# Altium schematic sheet Mixer to LP-HP Filter.SchDoc: Audio_Moduloop - Mixer/Filters
size A; Date: 2/27/2024; DrawnBy: Team 28: Ryan Gordon, Conor Curtin, Evan Roveili, Shawn Colby; DocumentNumber: 4; Revision: V1; SheetNumber: 4; SheetTotal: 7
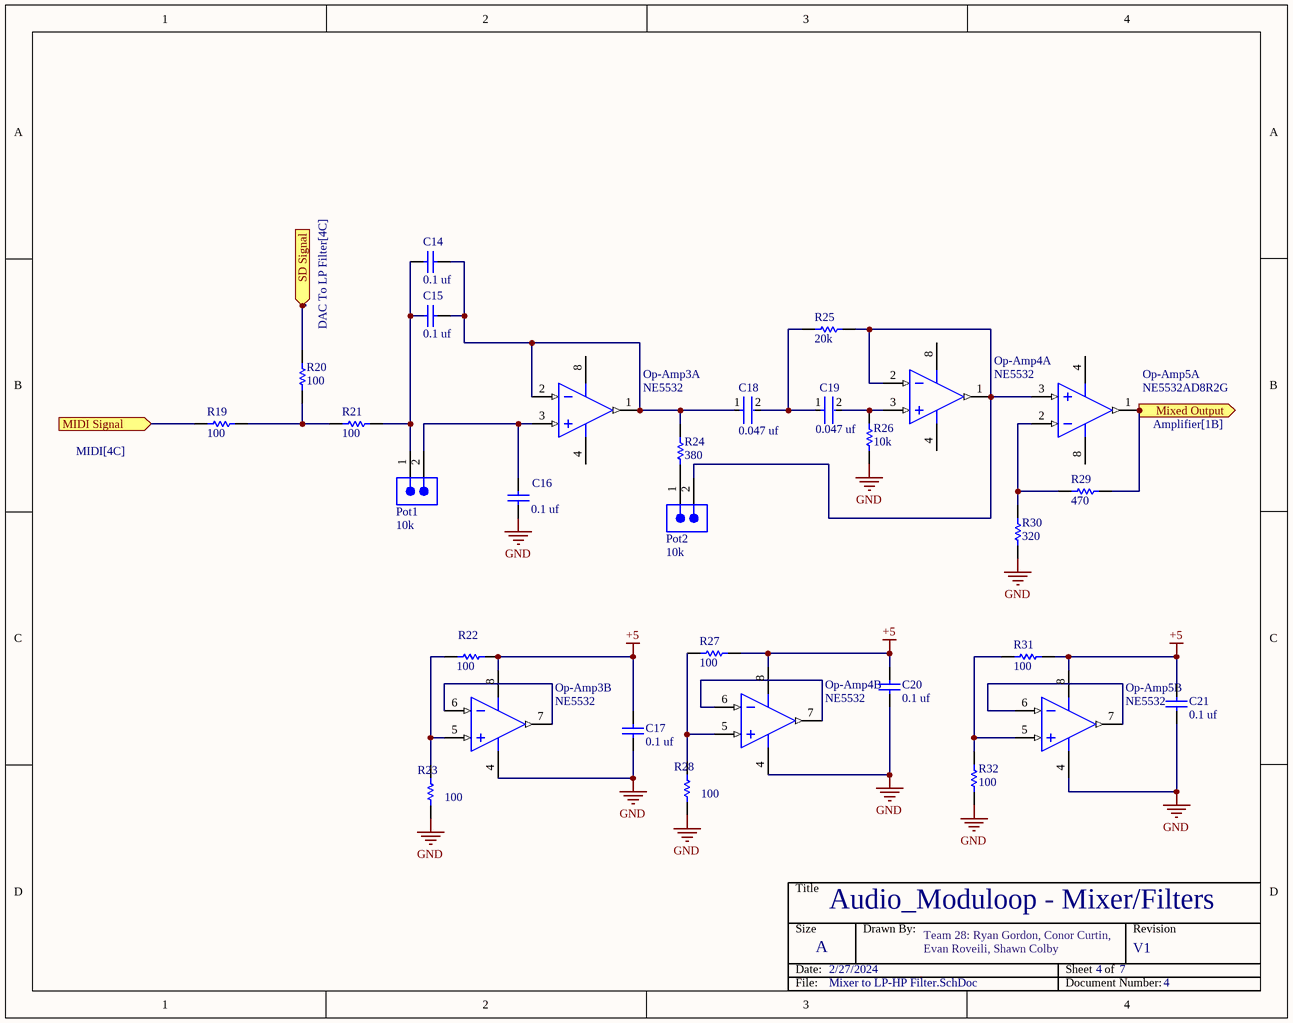
[diagram p0: Mixer to LP-HP Filter.SchDoc]

## Parts
C14  0.1 uf  [AVX-SA115C104KAR]
C15  0.1 uf  [AVX-SA115C104KAR]
C16  0.1 uf  [AVX-SA115C104KAR]
C17  0.1 uf  [AVX-SA115C104KAR]
C18  0.047 uf  [FP-RCE1K1-2_5-MFG]
C19  0.047 uf  [FP-RCE1K1-2_5-MFG]
C20  0.1 uf  [AVX-SA115C104KAR]
C21  0.1 uf  [AVX-SA115C104KAR]
Op-Amp3  NE5532  [ONSC-SOIC-8-751-07_V]  (parts A,B of 2)
Op-Amp4  NE5532  [ONSC-SOIC-8-751-07_V]  (parts A,B of 2)
Op-Amp5  NE5532AD8R2G  [ONSC-SOIC-8-751-07_V]  (parts A,B of 2)
Pot1  10k  [61300211121]
Pot2  10k  [61300211121]
R19  100  [RESC2013X60X40ML20T25]
R20  100  [RESC2013X60X40ML20T25]
R21  100  [RESC2013X60X40ML20T25]
R22  100  [RESC2013X60X40ML20T25]
R23  100  [RESC2013X60X40ML20T25]
R24  380  [RESC2013X60X40LL20T25]
R25  20k  [RESC2013X60X35NL10T20]
R26  10k  [RESC2013X60X35NL10T20]
R27  100  [RESC2013X60X40ML20T25]
R28  100  [RESC2013X60X40ML20T25]
R29  470  [RESC2013X60X40NL20T25]
R30  320  [RESC2013X60X40LL20T25]
R31  100  [RESC2013X60X40ML20T25]
R32  100  [RESC2013X60X40ML20T25]

## Ports
MIDI Signal (in, see MIDI[4C]), Mixed Output (out, see Amplifier[1B]), SD Signal (in, see DAC To LP Filter[4C])

## Nets
+5: C17.2 C20.2 C21.2 Op-Amp3.8(V+) Op-Amp4.8(V+) Op-Amp5.8(V+) R22.1 R27.1 R31.1
GND: C16.1 C17.1 C20.1 C21.1 Op-Amp3.4(V-) Op-Amp4.4(V-) Op-Amp5.4(V-) R23.1 R26.2 R28.1 R30.2 R32.2
MIDI Signal: R19.1 ; port MIDI Signal
Mixed Output: Op-Amp5.1(OUTA) R29.2 ; port Mixed Output
SD Signal: R20.1 ; port SD Signal
NetC14_1: C14.1 C15.1 Pot1.1 R21.1
NetC14_2: C14.2 C15.2 C18.1 Op-Amp3.1(OUTA) Op-Amp3.2(INA-) R24.1
NetC16_2: C16.2 Op-Amp3.3(INA+) Pot1.2
NetC18_2: C18.2 C19.1 R25.1
NetC19_2: C19.2 Op-Amp4.3(INA+) R26.1
NetOp-Amp3_5: Op-Amp3.5(INB+) R22.2 R23.2
NetOp-Amp3_6: Op-Amp3.6(INB-) Op-Amp3.7(OUTB)
NetOp-Amp4_1: Op-Amp4.1(OUTA) Op-Amp4.2(INA-) Op-Amp5.3(INA+) Pot2.2 R25.2
NetOp-Amp4_5: Op-Amp4.5(INB+) R27.2 R28.2
NetOp-Amp4_6: Op-Amp4.6(INB-) Op-Amp4.7(OUTB)
NetOp-Amp5_2: Op-Amp5.2(INA-) R29.1 R30.1
NetOp-Amp5_5: Op-Amp5.5(INB+) R31.2 R32.1
NetOp-Amp5_6: Op-Amp5.6(INB-) Op-Amp5.7(OUTB)
NetPot2_1: Pot2.1 R24.2
NetR19_2: R19.2 R20.2 R21.2

## Notes on the sheet
- Title
- Size
- Date:
- A
- Drawn By:
- Sheet    of
- Revision
- File:
- Document Number:

## Library data of the parts
C14-C17 C20 C21 = CMP-2000-07029-1: Axial Leads / SpinGuard(R), Ceramic Capacitor, 0.10 uF +/- 10%, 50V, -55 to 125 degC, 2-Pin THD, RoHS, Tape and Reel; Manufacturer: AVX; Other Names: 478-3151-1; Catalog Drawings: SASeries_4.32x3.05; Capacitance: 0.1µF; Temperature Coefficient: X7R; Online Catalog: SpinGuard®SASeries; Product Training Modules: ComponentSolutionsforSmartMeterApplications; Category: Capacitors; Package Description: 2-Pin Axial Lead, Dia 3.05 mm, Body Length 4.32 mm; Standard Package: 1; Mounting Technology: ThroughHole; Ratings: -; Datasheet Version: 06/2007; Voltage - Rated: 50V; Tolerance: ±10%; Package Reference: SA115C104KAR; Packaging: -; Lead Style: -; Size / Dimension: 0.120"Diax0.170"L(3.05mmx4.32mm); Mounting Type: ThroughHole; Operating Temperature: -55°C~125°C; Datasheet URL: https://datasheet.ciiva.com/27051/1074183-27051369.pdf; Applications: GeneralPurpose; Thickness (Max): -; Lead Spacing: -; Height - Seated (Max): -; Family: CeramicCapacitors; Package / Case: Axial; Features: -; Series: SpinGuard®SA; Manufacturer URL: http://www.avx.com/
C18 C19 = CMP-06035-044450-1: Cap Ceramic Monolithic 47nF 100V 10% Thru-Hole Bulk; Dielectric: X7R; Lead/Base Style: Formed Leads; Lead Diameter: 0.5mm; Tolerance: 10%; Width: 0.098inch; Max Operating Temperature: 125°C; Case/Package: Radial; Min Operating Temperature: -55°C; Ratings: AEC-Q200; Voltage Rating (DC): 100V; Packaging: Tape and Reel; Termination: Radial; Resistor Type: Ceramic; Voltage Rating: 100V; Height: 3.5mm; Capacitance: 47nF; Mount: Through Hole; Length: 0.157inch; Package Quantity: 2000; Height - Seated (Max): 0.138inch; Lead Pitch: 0.197inch
Op-Amp3 Op-Amp4 = CMP-1310-00252-1: Internally Compensated Dual Low Noise Operational Amplifier, 6 to 40 V, 0 to 70 degC, 8-Pin SOIC, Pb-Free, Tape and Reel; Manufacturer: On Semiconductor; PartNumber: NE5532AD8R2G; SR Typ (V/uS): 9; VCC Min (V): 6; VCC Max (V): 40; GBW Typ (MHz): 10; PackageVersion: Rev. AK, 02/2011; ComponentLink2URL: http://www.onsemi.cn/pub_link/Collateral/NE5532-D.PDF; RoHS: TRUE; PackageReference: SOIC-8-751-07; ComponentLink2Description: Datasheet; PackageDescription: 8-Pin Small Outline Integrated Circuit, Body 4.9 x 3.9 mm, Pitch 1.27 mm; ComponentLink3URL: http://www.onsemi.com/pub_link/Collateral/751-07.PDF; ComponentLink1Description: Manufacturer URL; DatasheetVersion: Rev. 2; Packing: Tape and Reel; ComponentLink1URL: http://www.onsemi.com/; ComponentLink3Description: Package Specification; Mounting Technology: Surface Mount
Op-Amp5 = CMP-1310-00252-1: Internally Compensated Dual Low Noise Operational Amplifier, 6 to 40 V, 0 to 70 degC, 8-Pin SOIC, Pb-Free, Tape and Reel; Manufacturer: On Semiconductor; SR Typ (V/uS): 9; VCC Min (V): 6; VCC Max (V): 40; GBW Typ (MHz): 10; PackageVersion: Rev. AK, 02/2011; ComponentLink2URL: http://www.onsemi.cn/pub_link/Collateral/NE5532-D.PDF; RoHS: TRUE; PackageReference: SOIC-8-751-07; ComponentLink2Description: Datasheet; PackageDescription: 8-Pin Small Outline Integrated Circuit, Body 4.9 x 3.9 mm, Pitch 1.27 mm; ComponentLink3URL: http://www.onsemi.com/pub_link/Collateral/751-07.PDF; ComponentLink1Description: Manufacturer URL; DatasheetVersion: Rev. 2; Packing: Tape and Reel; ComponentLink1URL: http://www.onsemi.com/; ComponentLink3Description: Package Specification; Mounting Technology: Surface Mount; PartNumber: NE5532AD8R2G
Pot1 Pot2 = CMP-1712-00002-5: NexarPartId: 20081794; Operating Supply Voltage: 250V; Current Rating: 3A; Gender: Male; Number of Contacts: 2; Pitch: 2.54mm; Connector Type: Male Pin; Contact Resistance: 20mΩ; Contact Plating: Gold; Contact Material: Copper; Number of Pins: 2; Min Operating Temperature: -40°C; Packaging: Bulk; Lead Pitch: 2.54mm; Mount: Through Hole; Orientation: Vertical; RoHS: Compliant; REACH SVHC: No SVHC; Height: 8.94mm; Termination: Through Hole; Number of Positions: 2; Contact Mating Length: 5.9944mm; Color: Black; Contact Gender: Male; Number of Rows: 1; Housing Material: PBT; Lead Free: Lead Free; Voltage Rating: 250V; Max Operating Temperature: 125°C
R19-R23 R27 R28 R31 R32 = CMP-2001-00580-1: Manufacturer: Panasonic; Part Number: ERA6AEB101V
R24 R30 = CMP-2001-00628-1: Manufacturer: Panasonic; Part Number: ERA6AEB331V
R25 R26 = CMP-1659-00013-4: Chip Resistor, 10 KOhm, +/- 1%, 0.125 W, -55 to 155 degC, 0805 (2012 Metric), RoHS, Tape and Reel; Manufacturer: Yageo; Voltage Rating: 150 V; Mount: Surface Mount; ComponentLink1Description: Manufacturer URL; ComponentLink2URL: http://www.yageo.com/documents/recent/PYu-RC_Group_51_RoHS_L_04.pdf; Pins: 2; Length: 2 mm; Min Operating Temperature: -55 degC; Height: 0.5 mm; Mounting Technology: Surface Mount; RoHSCompliant: true; REACH SVHC: No SVHC; ComponentLink1URL: http://www.yageo.com/; Max Operating Temperature: 155 degC; PackageReference: 0805; DatasheetVersion: Rev. 4, 02/2016; Package Quantity: 5000; Packaging: Tape and Reel; ComponentLink2Description: Datasheet; PackageDescription: 2-Pin Surface Mounted Device, Body 2 x 1.25 mm
R29 = CMP-2001-00643-1: Part Number: ERA6AEB471V; Manufacturer: Panasonic